# Altium schematic sheet SCH.SchDoc
size A4; Author: Audran; CompanyName: Goldorak; Address1: Electrolab; Address2: 52 rue Paul Lescop; Address3: 92000 Nanterre; ProjectName: Cartes_2017
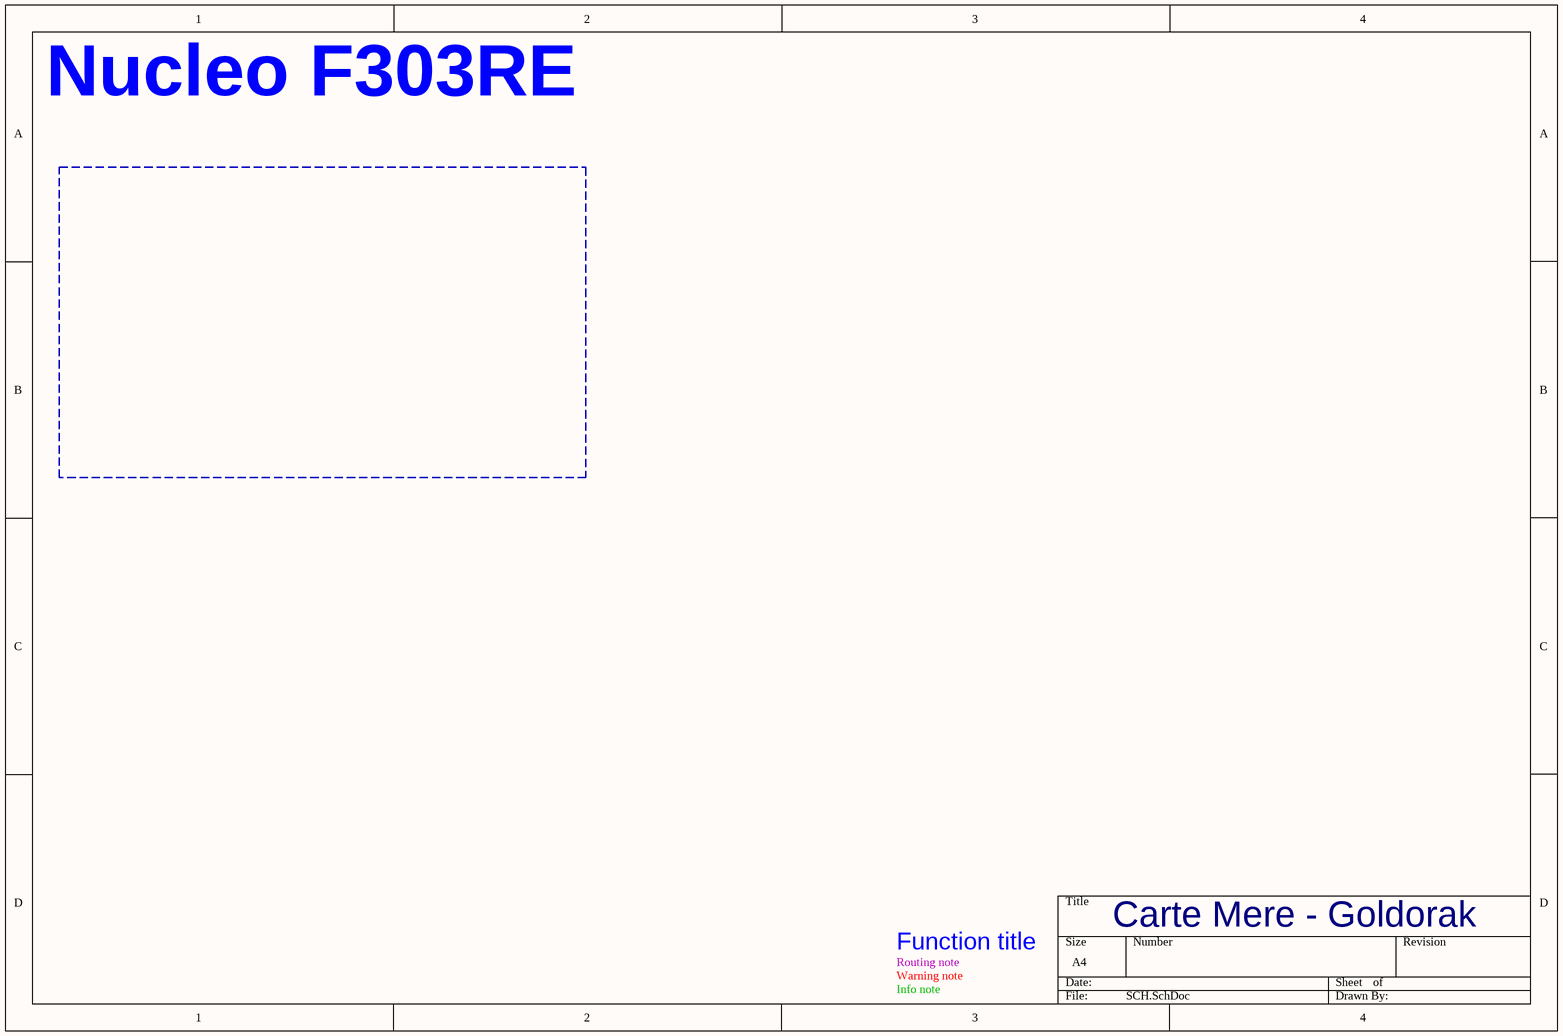
[diagram p0: SCH.SchDoc]

## Notes on the sheet
- Nucleo F303RE
- Routing note
- Warning note
- Function title
- Carte Mere - Goldorak
- Info note